# Altium schematic sheet Bluetooth.SchDoc
size 420 x 297 mm; SheetNumber: 3; SheetTotal: 5; Разработчик: Волков; Проверяющий: Андрейчук; Технический_контроль: Ашуркевич; Нормативный_контроль: Василевская; Утвердил: Чвала; Номер_листа: 1; Количество_листов: 4; Организация: МРК; Номер_документа: ТЗСЦ.421457.001Э3; Название_документа: Устройство управления сервоприводами на основе микроконтроллера STM32
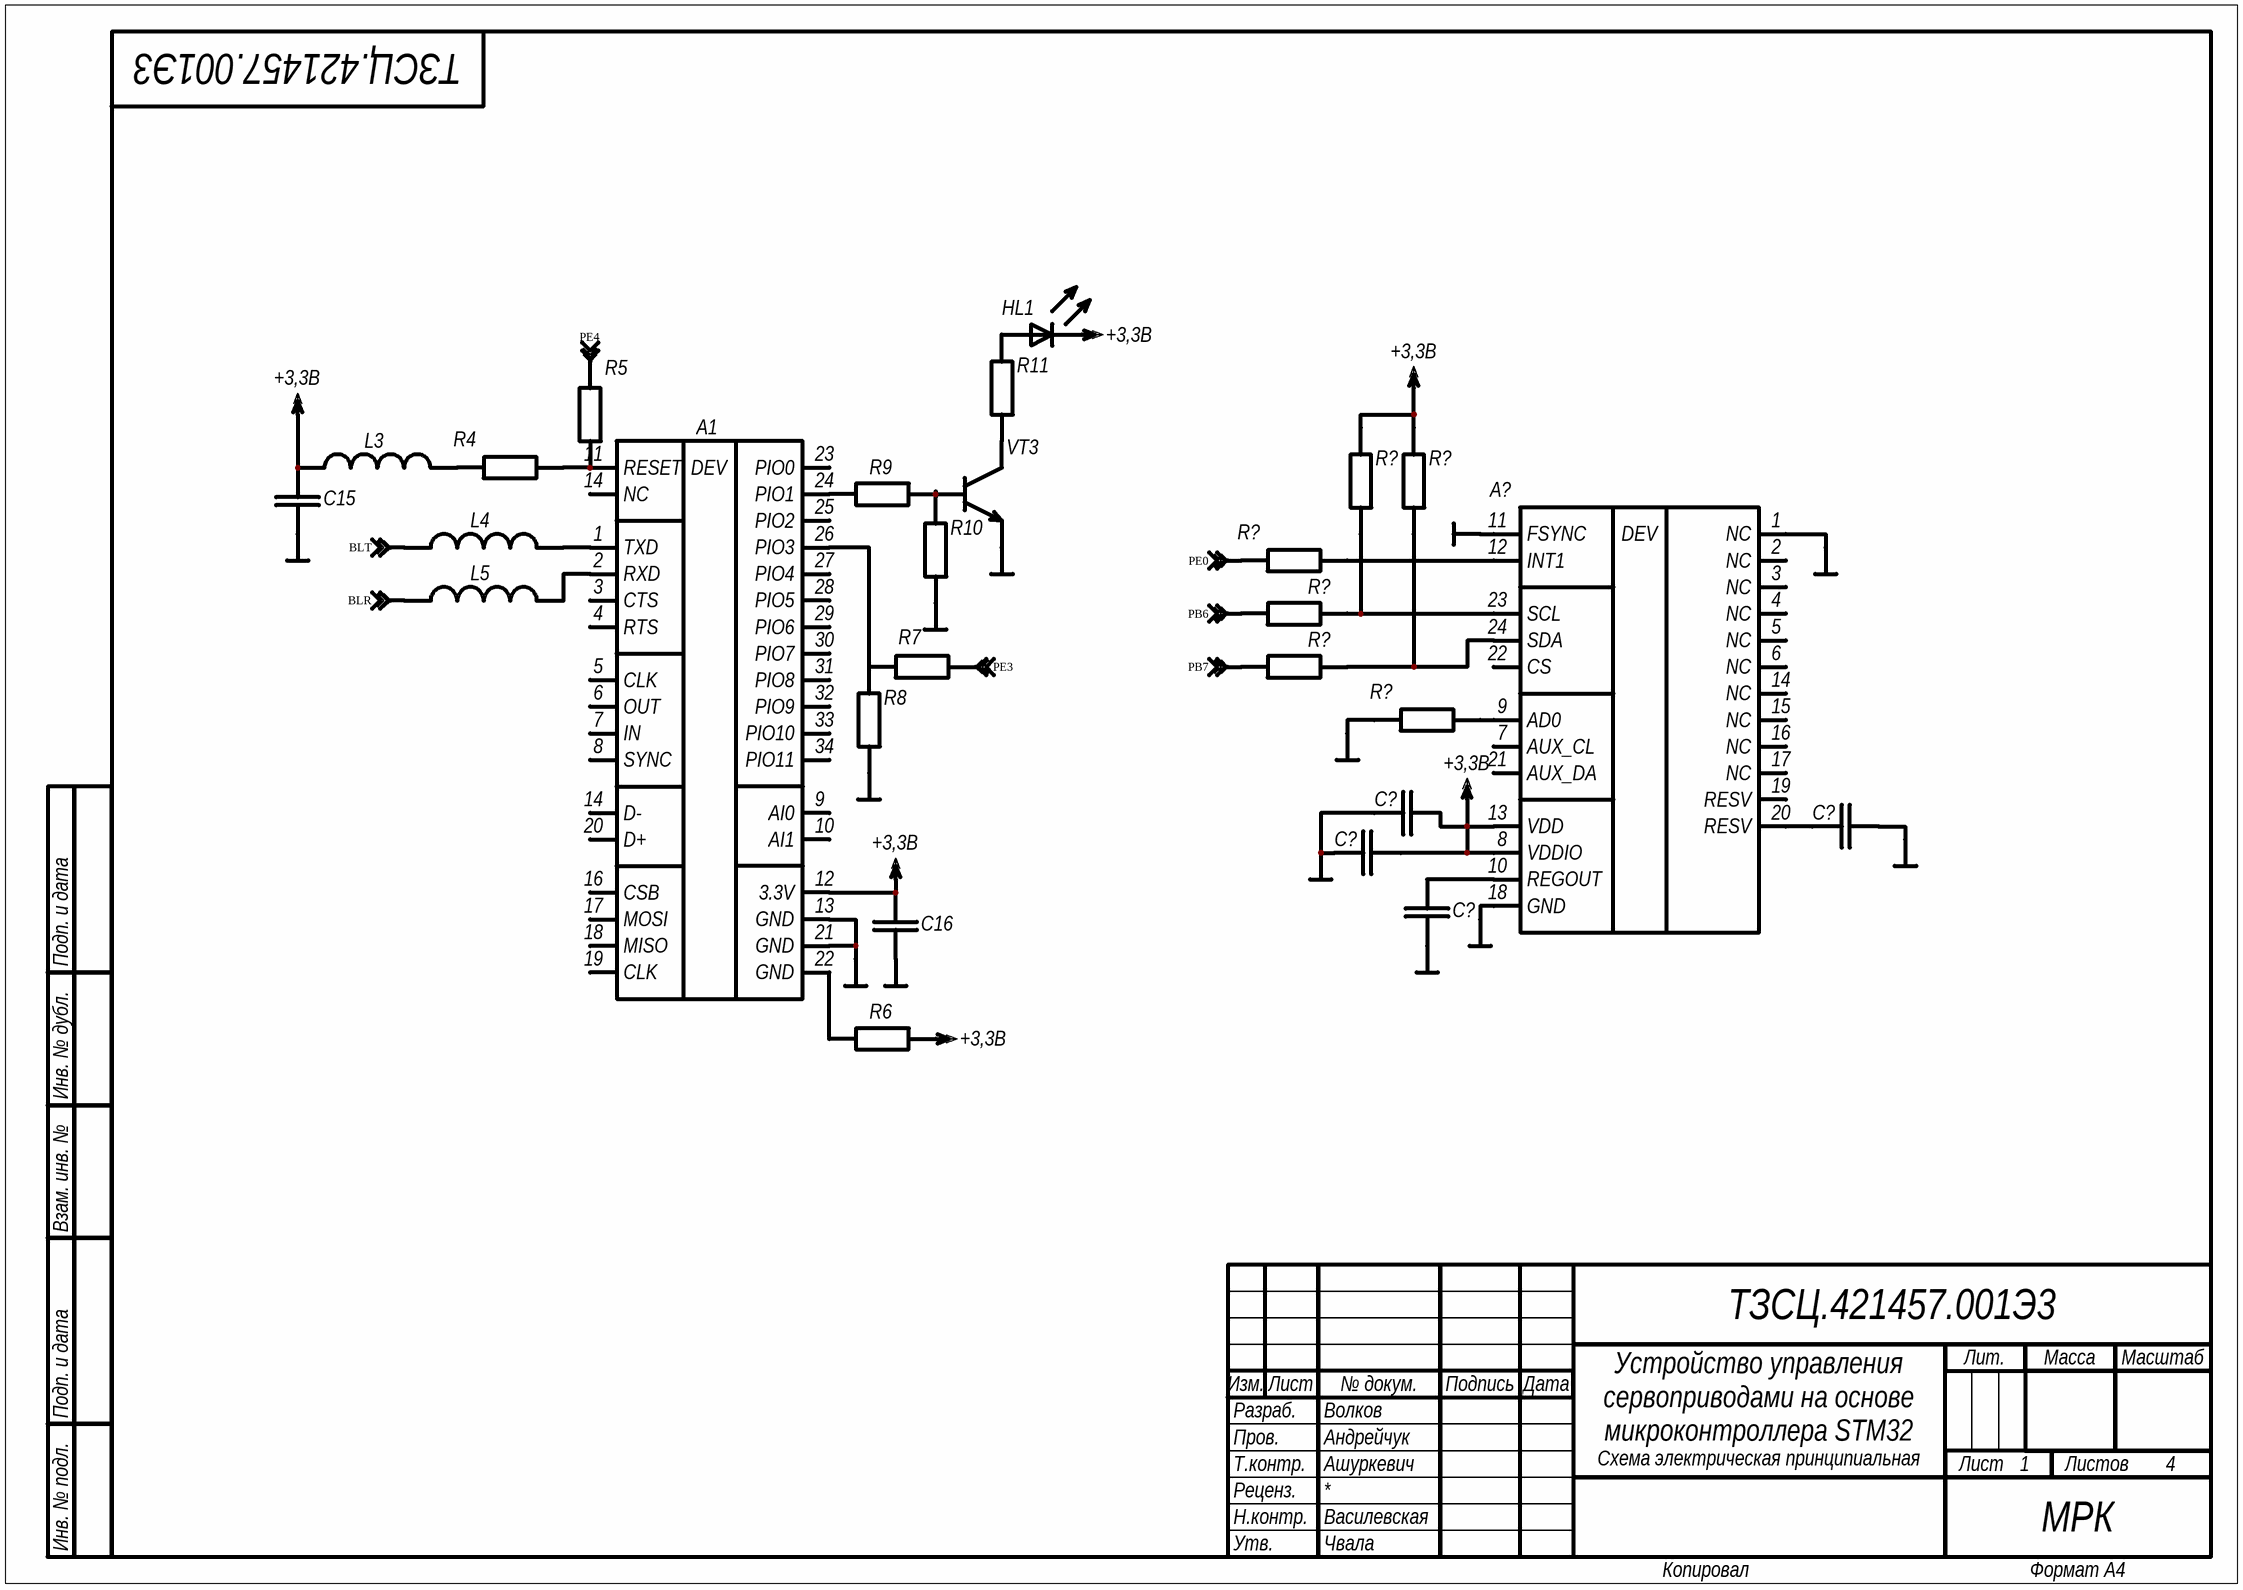
[diagram p0: Bluetooth.SchDoc]

## Parts
(Parts that share a designator on the sheet are numbered #1, #2 ... from top to bottom, then left to right.)
A1  HC-06  (value not drawn)
A?  ICM-20948  (value not drawn)
C15  Capacitor_Fixed  (value not drawn)
C16  Capacitor_Fixed  (value not drawn)
C?#1  Capacitor_Fixed  (value not drawn)
C?#2  Capacitor_Fixed  (value not drawn)
C?#3  Capacitor_Fixed  (value not drawn)
C?#4  Capacitor_Fixed  (value not drawn)
HL1  Diode_Light_Emitting  (value not drawn)
L3  Inductor  (value not drawn)
L4  Inductor  (value not drawn)
L5  Inductor  (value not drawn)
R4  Resistor_Fixed  (value not drawn)
R5  Resistor_Fixed  (value not drawn)
R6  Resistor_Fixed  (value not drawn)
R7  Resistor_Fixed  (value not drawn)
R8  Resistor_Fixed  (value not drawn)
R9  Resistor_Fixed  (value not drawn)
R10  Resistor_Fixed  (value not drawn)
R11  Resistor_Fixed  (value not drawn)
R?#1  Resistor_Fixed  (value not drawn)
R?#2  Resistor_Fixed  (value not drawn)
R?#3  Resistor_Fixed  (value not drawn)
R?#4  Resistor_Fixed  (value not drawn)
R?#5  Resistor_Fixed  (value not drawn)
R?#6  Resistor_Fixed  (value not drawn)
VT3  BC817  (value not drawn)

## Nets
+3,3В: A1.12(3.3V) A?.8(VDDIO) A?.13(VDD) C15.2 C16.1 C?#1.2 C?#3.2 HL1.2(Cathode) L3.1 R6.1 R?#1.2 R?#2.2
GND: A1.13(GND) A1.21(GND) A?.1(NC) A?.11(FSYNC) A?.18(GND) C15.1 C16.2 C?#1.1 C?#2.2 C?#3.1 C?#4.1 R8.1 R10.1 R?#6.1 VT3.2(Emitter)
BLR: L5.1 ; off-sheet BLR
BLT: L4.1 ; off-sheet BLT
PB6: R?#4.1 ; off-sheet PB6
PB7: R?#5.1 ; off-sheet PB7
PE0: R?#3.1 ; off-sheet PE0
PE3: R7.2 ; off-sheet PE3
PE4: R5.2 ; off-sheet PE4
NetA1_1: A1.1(TXD) L4.2
NetA1_2: A1.2(RXD) L5.2
NetA1_11: A1.11(RESET) R4.2 R5.1
NetA1_22: A1.22(GND) R6.2
NetA1_24: A1.24(PIO1) R9.2
NetA1_26: A1.26(PIO3) R7.1 R8.2
NetA?_9: A?.9(AD0) R?#6.2
NetA?_10: A?.10(REGOUT) C?#4.2
NetA?_12: A?.12(INT1) R?#3.2
NetA?_20: A?.20(RESV) C?#2.1
NetA?_23: A?.23(SCL) R?#1.1 R?#4.2
NetA?_24: A?.24(SDA) R?#2.1 R?#5.2
NetHL1_1: HL1.1(Anode) R11.2
NetL3_2: L3.2 R4.1
NetR9_1: R9.1 R10.2 VT3.1(Base)
NetR11_1: R11.1 VT3.3(Collector)

Not connected (* = marked no-connect by the designer): A1 3(CTS) 4(RTS) 5(CLK) 6(OUT) 7(IN) 8(SYNC) 9(AI0) 10(AI1) 14(NC) 16(CSB) 17(MOSI) 18(MISO) 19(CLK) 20(D+) 23(PIO0) 25(PIO2) 27(PIO4) 28(PIO5) 29(PIO6) 30(PIO7) 31(PIO8) 32(PIO9) 33(PIO10) 34(PIO11); A? 2(NC) 3(NC) 4(NC) 5(NC) 6(NC) 7(AUX_CL) 14(NC) 15(NC) 16(NC) 17(NC) 19(RESV) 21(AUX_DA) 22(CS)

## Notes on the sheet
- Подп. и дата
- Инв. № дубл.
- Взам. инв. №
- Разраб.
- Изм.
- Лист
- № докум.
- Подпись
- Дата
- Лит.
- Масса
- Масштаб
- Пров.
- Т.контр.
- Схема электрическая принципиальная
- Листов
- Реценз.
- Н.контр.
- Утв.
- Инв. № подл.
- Копировал
- Формат А4
- (in symbol Device_Bluetooth_HC-06) DEV
- (in symbol Device_Gyroscope_Accelerometer_ICM-20948) DEV

## Library data of the parts
A1 = Device_Bluetooth_HC-06: 34 pin 3,3V; ComponentLink1Description: chipdip; ComponentLink1URL: https://www.chipdip.ru/product/hc-06; ComponentLink2Description: datasheet; ComponentLink2URL: https://static.chipdip.ru/lib/734/DOC021734960.pdf; ComponentLink3Description: elecbee; ComponentLink3URL: https://www.elecbee.com/en-24700-RS232-TTL-HC-06-Wireless-bluetooth-RF-Transceiver-Serial-Module
A? = Device_Gyroscope_Accelerometer_ICM-20948: 24 pin 3,3V; ComponentLink1Description: chipdip; ComponentLink1URL: https://www.chipdip.ru/product0/8025239061; ComponentLink2Description: datasheet; ComponentLink2URL: https://static.chipdip.ru/lib/718/DOC011718862.pdf
C15 C16 C?#1-C?#4 = Capacitor_Fixed: 2 pin
HL1 = Diode_Light_Emitting: 2 pin
L3-L5 = Inductor: 2 pin
R4-R11 R?#1-R?#6 = Resistor_Fixed: 2 pin
VT3 = Transistor_Bipolar_NPN_BC817: 3 pin; ComponentLink1Description: chipdip; ComponentLink1URL: https://www.chipdip.by/product/bc817-40; ComponentLink2Description: datasheet; ComponentLink2URL: https://static.chipdip.ru/lib/156/DOC000156781.pdf